# Altium schematic sheet 步进电机控制电路.SchDoc
size A4
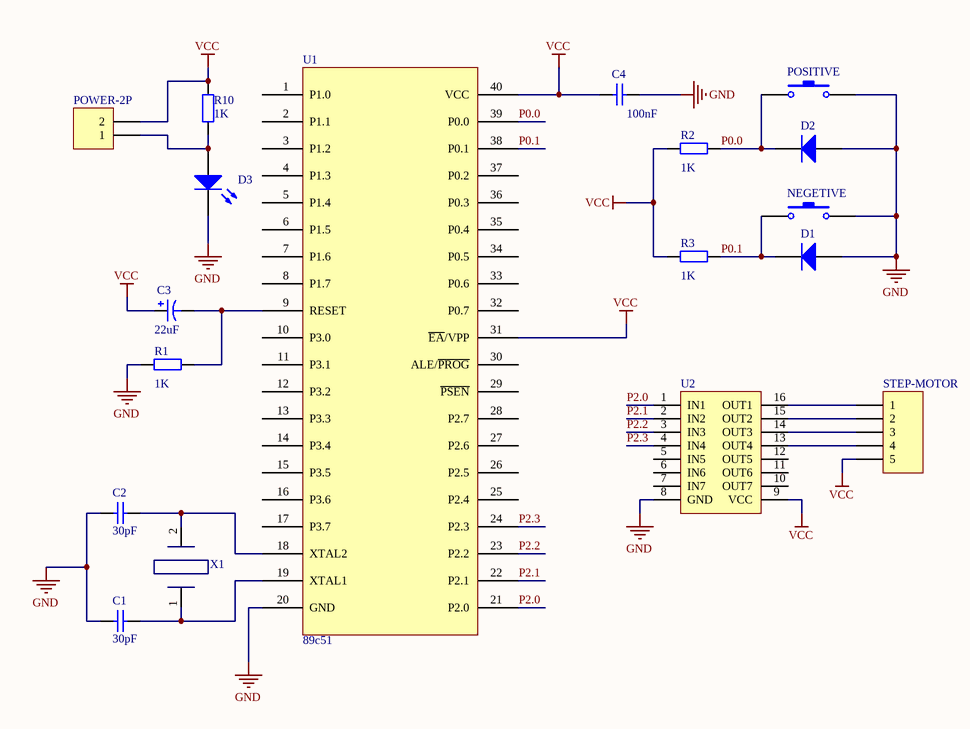
[diagram p0: 步进电机控制电路.SchDoc]

## Parts
C1  value 30pF  [RAD-0.3]  (hidden comment: Cap)
C2  value 30pF  [RAD-0.3]  (hidden comment: Cap)
C3  value 22uF  [RB7.6-15]  (hidden comment: Cap Pol1)
C4  value 100nF  [RAD-0.3]  (hidden comment: Cap)
D1  Diode 1N4148  [DO-35]  (value not drawn)
D2  Diode 1N4148  [DO-35]  (value not drawn)
D3  D3  [LED-0]  (value not drawn)
NEGETIVE  SW-PB  [SPST-2]  (value not drawn)
POSITIVE  SW-PB  [SPST-2]  (value not drawn)
POWER-2P  Header 2  [HDR1X2]  (value not drawn)
R1  value 1K  [AXIAL-0.4]  (hidden comment: Res2)
R2  value 1K  [AXIAL-0.4]  (hidden comment: Res2)
R3  value 1K  [AXIAL-0.4]  (hidden comment: Res2)
R10  value 1K  [AXIAL-0.4]  (hidden comment: Res2)
STEP-MOTOR  Header 5  [HDR1X5]  (value not drawn)
U1  89c51  [89c51]
U2  Component_1  [ULN2003]  (value not drawn)
X1  Component_1  [LC-HC-49S]  (value not drawn)

## Nets
GND: C1.2 C2.2 C4.2 D1.1(A) D2.1(A) D3.2(K) NEGETIVE.2 POSITIVE.2 R1.1 U1.20(GND) U2.8(GND)
VCC: C3.1 C4.1 POWER-2P.2 R2.1 R3.1 R10.2 STEP-MOTOR.5 U1.31(~{EA}/VPP) U1.40(VCC) U2.9(VCC)
P0.0: D2.2(K) POSITIVE.1 R2.2 U1.39(P0.0)
P0.1: D1.2(K) NEGETIVE.1 R3.2 U1.38(P0.1)
P2.0: U1.21(P2.0) U2.1(IN1)
P2.1: U1.22(P2.1) U2.2(IN2)
P2.2: U1.23(P2.2) U2.3(IN3)
P2.3: U1.24(P2.3) U2.4(IN4)
NetC1_1: C1.1 U1.19(XTAL1) X1.1
NetC2_1: C2.1 U1.18(XTAL2) X1.2
NetC3_2: C3.2 R1.2 U1.9(RESET)
NetD3_1: D3.1(A) POWER-2P.1 R10.1
NetSTEP-MOTOR_1: STEP-MOTOR.1 U2.16(OUT1)
NetSTEP-MOTOR_2: STEP-MOTOR.2 U2.15(OUT2)
NetSTEP-MOTOR_3: STEP-MOTOR.3 U2.14(OUT3)
NetSTEP-MOTOR_4: STEP-MOTOR.4 U2.13(OUT4)

Not connected (* = marked no-connect by the designer): U1 1(P1.0) 2(P1.1) 3(P1.2) 4(P1.3) 5(P1.4) 6(P1.5) 7(P1.6) 8(P1.7) 10(P3.0) 11(P3.1) 12(P3.2) 13(P3.3) 14(P3.4) 15(P3.5) 16(P3.6) 17(P3.7) 25(P2.4) 26(P2.5) 27(P2.6) 28(P2.7) 29(~{PSEN}) 30(ALE/~{PROG}) 32(P0.7) 33(P0.6) 34(P0.5) 35(P0.4) 36(P0.3) 37(P0.2); U2 5(IN5) 6(IN6) 7(IN7) 10(OUT7) 11(OUT6) 12(OUT5)

## Library data of the parts
C1 C2 C4 = Cap: Capacitor; Published: 8-Jun-2000; LatestRevisionDate: 17-Jul-2002; LatestRevisionNote: Re-released for DXP Platform.; PackageReference: RAD-0.3; Publisher: Altium Limited; PackageDescription: Radial Cap, Thru-Hole; 2 Leads; 0.3 in Pin Spacing
C3 = Cap Pol1: Polarized Capacitor (Radial); Published: 8-Jun-2000; LatestRevisionDate: 17-Jul-2002; LatestRevisionNote: Re-released for DXP Platform.; PackageReference: RB7.6-15; Publisher: Altium Limited; PackageDescription: Polarized Capacitor (Radial); 2 Leads
D1 D2 = Diode 1N4148: High Conductance Fast Diode; Published: 8-Jun-2000; LatestRevisionDate: 17-Jul-2002; LatestRevisionNote: Re-released for DXP Platform.; DatasheetVersion: 1997; PackageReference: DO-35; Publisher: Altium Limited; PackageDescription: Diode, Axial; Body 3.8 x 1.9 mm (LxDia. max), Lead Dia. 0.53 mm (max); Code_JEDEC: DO-204-AH; ComponentLink1Description: Manufacturer Link; ComponentLink1URL: http://www.fairchildsemi.com/; ComponentLink2Description: Datasheet; ComponentLink2URL: http://www.fairchildsemi.com/ds/1N%2F1N4148.pdf
D3 = LED0: Typical INFRARED GaAs LED; Published: 8-Jun-2000; LatestRevisionDate: 08-Jul-2005; LatestRevisionNote: Mech Layer 1 removed.; PackageReference: LED-0; Publisher: Altium Limited; PackageDescription: LED; 2 Leads
NEGETIVE POSITIVE = SW-PB: Switch; Published: 24-Mar-1999; LatestRevisionDate: 17-Jul-2002; LatestRevisionNote: Re-released for DXP Platform.; PackageReference: SPST-2; Publisher: Altium Limited; PackageDescription: Switch; 2 Leads
POWER-2P = Header 2: Header, 2-Pin; LatestRevisionDate: 17-Jul-2002; LatestRevisionNote: Re-released for DXP Platform.; Publisher: Altium Limited
R1-R3 R10 = Res2: Resistor; Published: 8-Jun-2000; LatestRevisionDate: 17-Jul-2002; LatestRevisionNote: Re-released for DXP Platform.; PackageReference: AXIAL-0.4; Publisher: Altium Limited; PackageDescription: Axial Device, Thru-Hole; 2 Leads; 0.4 in Pin Spacing
STEP-MOTOR = Header 5: Header, 5-Pin; LatestRevisionDate: 17-Jul-2002; LatestRevisionNote: Re-released for DXP Platform.; Publisher: Altium Limited
U1 = Component_1